# Altium schematic sheet UC-521.SchDoc
size A3
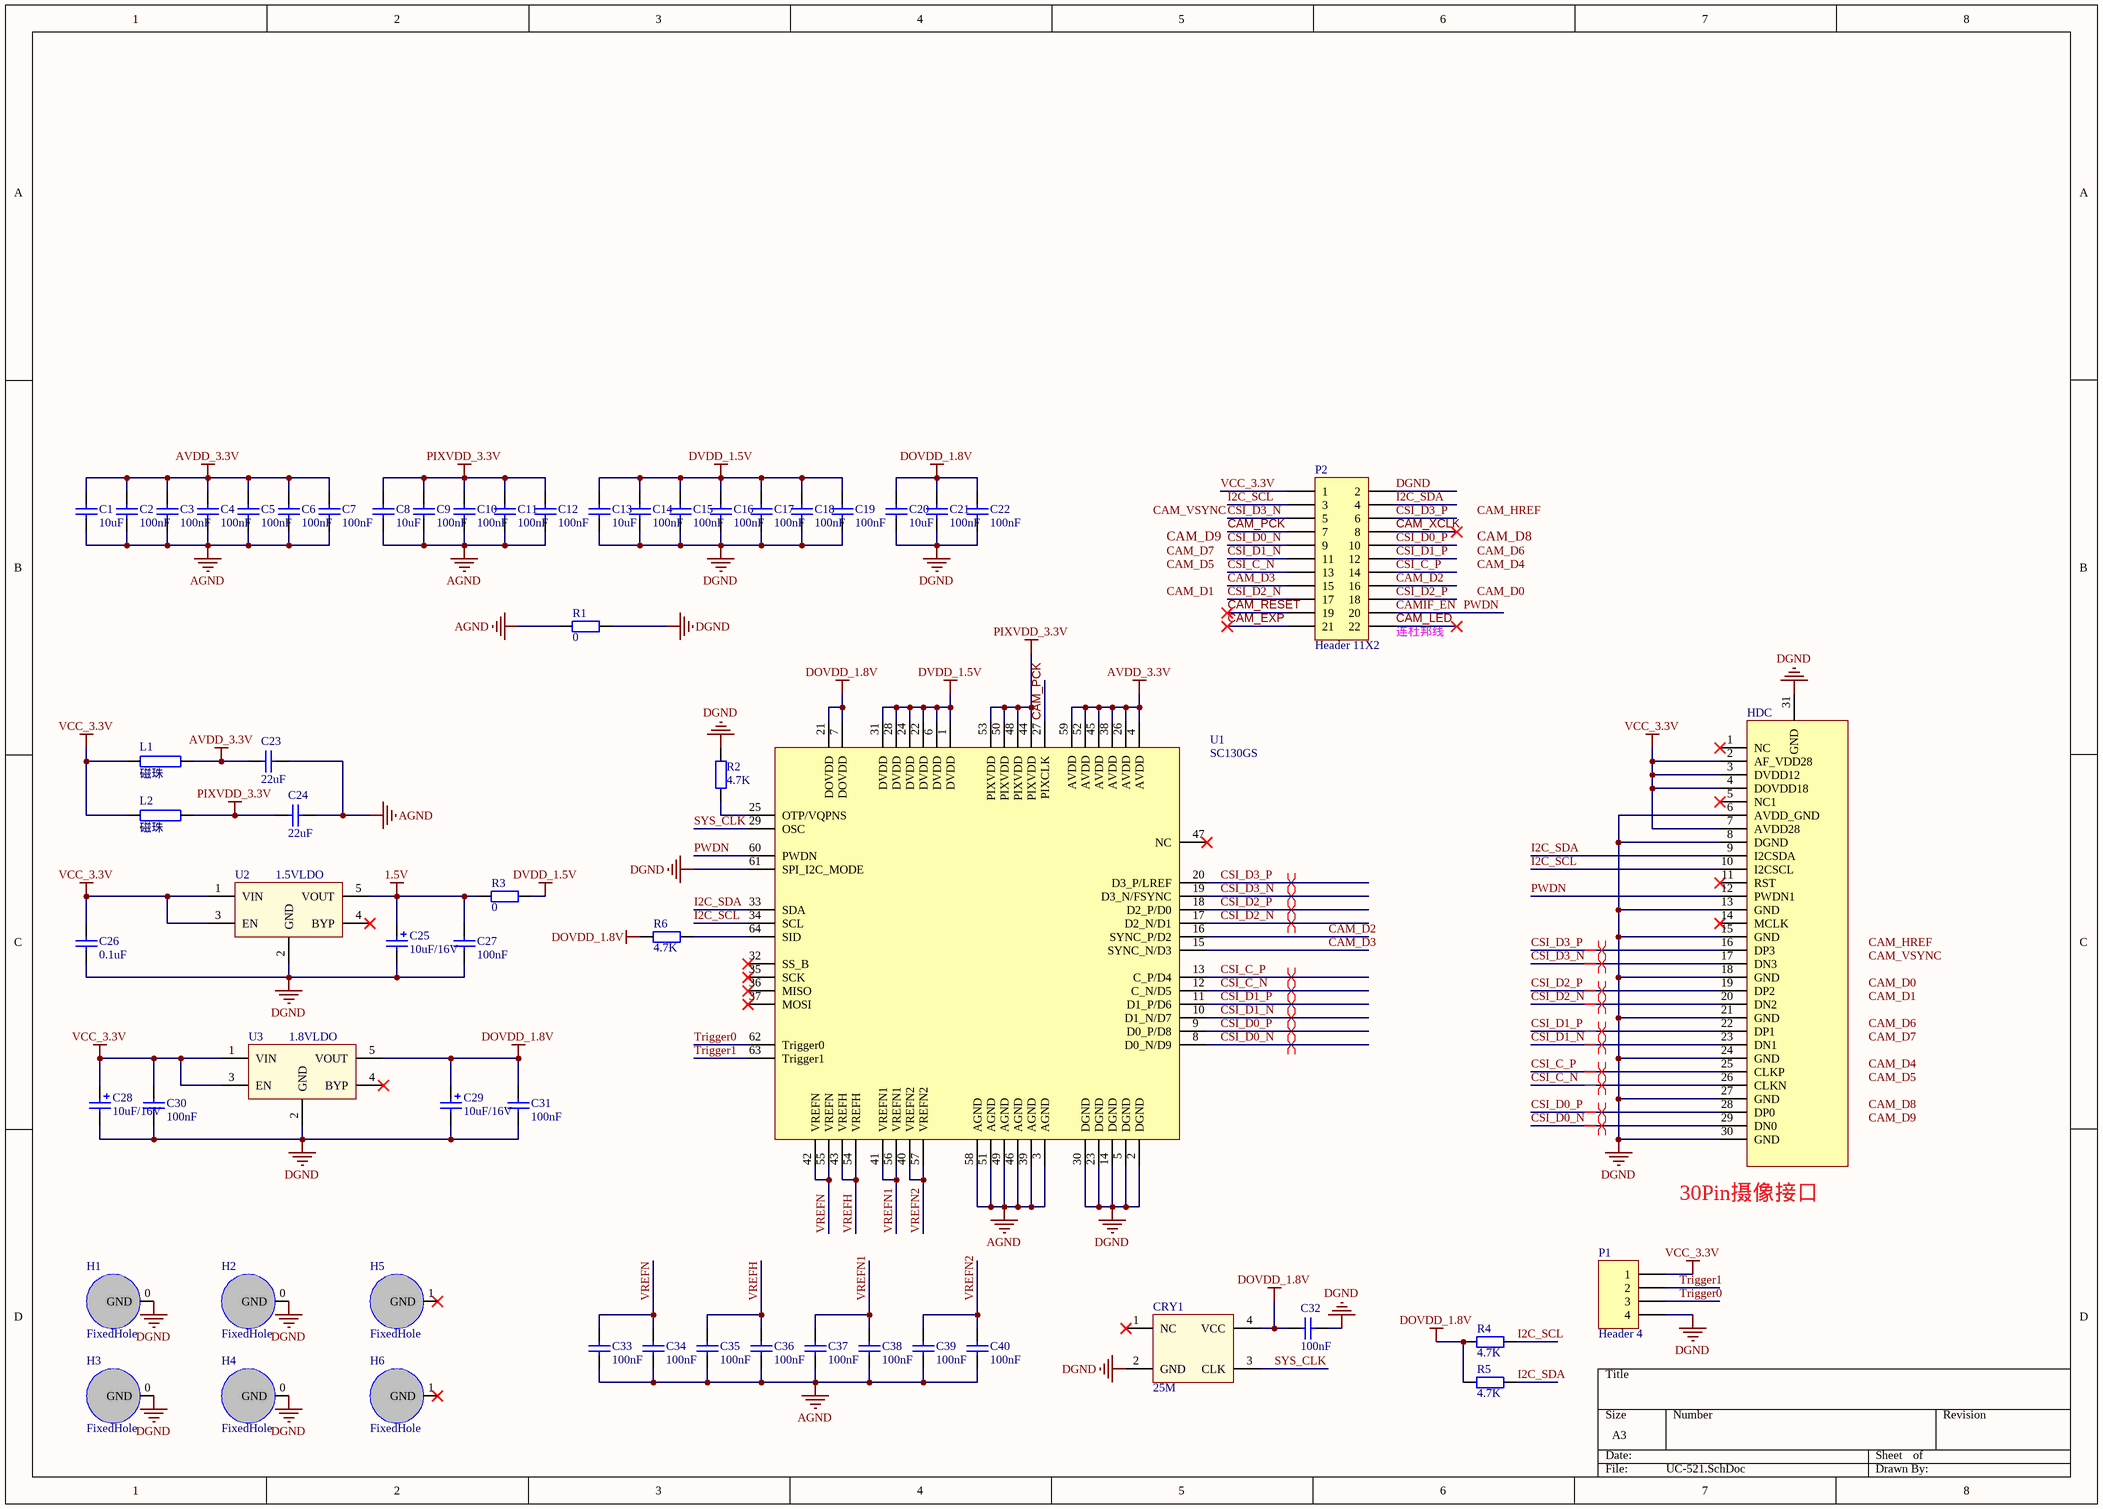
[diagram p0: UC-521.SchDoc]

## Parts
C1  10uF  [C0603]
C2  100nF  [C0603]
C3  100nF  [C0603]
C4  100nF  [C0603]
C5  100nF  [C0603]
C6  100nF  [C0603]
C7  100nF  [C0603]
C8  10uF  [C0603]
C9  100nF  [C0603]
C10  100nF  [C0603]
C11  100nF  [C0603]
C12  100nF  [C0603]
C13  10uF  [C0603]
C14  100nF  [C0603]
C15  100nF  [C0603]
C16  100nF  [C0603]
C17  100nF  [C0603]
C18  100nF  [C0603]
C19  100nF  [C0603]
C20  10uF  [C0603]
C21  100nF  [C0603]
C22  100nF  [C0603]
C23  22uF  [C0603]
C24  22uF  [C0603]
C25  10uF/16V  [钽电容（A型）]
C26  0.1uF  [C0603]
C27  100nF  [C0603]
C28  10uF/16V  [钽电容（A型）]
C29  10uF/16V  [钽电容（A型）]
C30  100nF  [C0603]
C31  100nF  [C0603]
C32  100nF  [C0603]
C33  100nF  [C0603]
C34  100nF  [C0603]
C35  100nF  [C0603]
C36  100nF  [C0603]
C37  100nF  [C0603]
C38  100nF  [C0603]
C39  100nF  [C0603]
C40  100nF  [C0603]
CRY1  25M  [爱普生晶振3.2×2.5MM]
H1  FixedHole  [HOLE_M2]
H2  FixedHole  [HOLE_M2]
H3  FixedHole  [HOLE_M2]
H4  FixedHole  [HOLE_M2]
H5  FixedHole  [HOLE_M2]
H6  FixedHole  [HOLE_M2]
HDC  Component_1  [FH12-30S-0.5SH]  (value not drawn)
L1  磁珠  [L0603]
L2  磁珠  [L0603]
P1  Header 4  [HDR1X4]
P2  Header 11X2  [HDR2X11]
R1  0  [R0603]
R2  4.7K  [R0603]
R3  0  [R0603]
R4  4.7K  [R0603]
R5  4.7K  [R0603]
R6  4.7K  [R0603]
U1  SC130GS  [LCC64-SC130GS]
U2  1.5VLDO  [SOT23-5]
U3  1.8VLDO  [SOT23-5]

## Nets
1.5V: C25.1 C27.1 R3.1 U2.5(VOUT)
AGND: C1.2 C2.2 C3.2 C4.2 C5.2 C6.2 C7.2 C8.2 C9.2 C10.2 C11.2 C12.2 C23.1 C24.1 C33.2 C34.2 C35.2 C36.2 C37.2 C38.2 C39.2 C40.2 R1.1 U1.3(AGND) U1.39(AGND) U1.46(AGND) U1.49(AGND) U1.51(AGND) U1.58(AGND)
AVDD_3.3V: C1.1 C2.1 C3.1 C4.1 C5.1 C6.1 C7.1 C23.2 L1.2 U1.4(AVDD) U1.26(AVDD) U1.38(AVDD) U1.45(AVDD) U1.52(AVDD) U1.59(AVDD)
DGND: C13.2 C14.2 C15.2 C16.2 C17.2 C18.2 C19.2 C20.2 C21.2 C22.2 C25.2 C26.2 C27.2 C28.2 C29.2 C30.2 C31.2 C32.2 CRY1.2(GND) H1.0(GND) H2.0(GND) H3.0(GND) H4.0(GND) HDC.6(AVDD_GND) HDC.8(DGND) HDC.13(GND) HDC.15(GND) HDC.18(GND) HDC.21(GND) HDC.24(GND) HDC.27(GND) HDC.30(GND) HDC.31(GND) P1.4 P2.2 R1.2 R2.1 U1.2(DGND) U1.5(DGND) U1.14(DGND) U1.23(DGND) U1.30(DGND) U1.61(SPI_I2C_MODE) U2.2(GND) U3.2(GND)
DOVDD_1.8V: C20.1 C21.1 C22.1 C29.1 C31.1 C32.1 CRY1.4(VCC) R4.1 R5.1 R6.1 U1.7(DOVDD) U1.21(DOVDD) U3.5(VOUT)
DVDD_1.5V: C13.1 C14.1 C15.1 C16.1 C17.1 C18.1 C19.1 R3.2 U1.1(DVDD) U1.6(DVDD) U1.22(DVDD) U1.24(DVDD) U1.28(DVDD) U1.31(DVDD)
PIXVDD_3.3V: C8.1 C9.1 C10.1 C11.1 C12.1 C24.2 L2.1 U1.44(PIXVDD) U1.48(PIXVDD) U1.50(PIXVDD) U1.53(PIXVDD)
VCC_3.3V: C26.1 C28.1 C30.1 HDC.2(AF_VDD28) HDC.3(DVDD12) HDC.4(DOVDD18) HDC.7(AVDD28) L1.1 L2.2 P1.1 P2.1 U2.1(VIN) U2.3(EN) U3.1(VIN) U3.3(EN)
CAM_D2: P2.16 U1.16(SYNC_P/D2)
CAM_D3: P2.15 U1.15(SYNC_N/D3)
CAM_EXP: P2.21
CAM_LED: P2.22
CAM_PCK: P2.7 U1.27(PIXCLK)
CAM_RESET: P2.19
CAM_XCLK: P2.8
CAMIF_EN: HDC.12(PWDN1) P2.20 U1.60(PWDN)  [also labelled PWDN]
CSI_C_N: HDC.26(CLKN) P2.13 U1.12(C_N/D5)
CSI_C_P: HDC.25(CLKP) P2.14 U1.13(C_P/D4)
CSI_D0_N: HDC.29(DN0) P2.9 U1.8(D0_N/D9)
CSI_D0_P: HDC.28(DP0) P2.10 U1.9(D0_P/D8)
CSI_D1_N: HDC.23(DN1) P2.11 U1.10(D1_N/D7)
CSI_D1_P: HDC.22(DP1) P2.12 U1.11(D1_P/D6)
CSI_D2_N: HDC.20(DN2) P2.17 U1.17(D2_N/D1)
CSI_D2_P: HDC.19(DP2) P2.18 U1.18(D2_P/D0)
CSI_D3_N: HDC.17(DN3) P2.5 U1.19(D3_N/FSYNC)
CSI_D3_P: HDC.16(DP3) P2.6 U1.20(D3_P/LREF)
I2C_SCL: HDC.10(I2CSCL) P2.3 R4.2 U1.34(SCL)
I2C_SDA: HDC.9(I2CSDA) P2.4 R5.2 U1.33(SDA)
SYS_CLK: CRY1.3(CLK) U1.29(OSC)
Trigger0: P1.3 U1.62(Trigger0)
Trigger1: P1.2 U1.63(Trigger1)
VREFH: C35.1 C36.1 U1.43(VREFH) U1.54(VREFH)
VREFN: C33.1 C34.1 U1.42(VREFN) U1.55(VREFN)
VREFN1: C37.1 C38.1 U1.41(VREFN1) U1.56(VREFN1)
VREFN2: C39.1 C40.1 U1.40(VREFN2) U1.57(VREFN2)
NetR2_2: R2.2 U1.25(OTP/VQPNS)
NetR6_2: R6.2 U1.64(SID)

Not connected (* = marked no-connect by the designer): CRY1 1(NC)*; H5 1(GND)*; H6 1(GND)*; HDC 1(NC)* 5(NC1)* 11(RST)* 14(MCLK)*; U1 32(SS_B)* 35(SCK)* 36(MISO)* 37(MOSI)* 47(NC)*; U2 4(BYP)*; U3 4(BYP)*

## Layout directives
differential pair: CSI_C_N, CSI_C_P, CSI_D0_N, CSI_D0_P, CSI_D1_N, CSI_D1_P, CSI_D2_N, CSI_D2_P, CSI_D3_N, CSI_D3_P

## Notes on the sheet
- (near P2) 连杜邦线
- (near HDC) 30Pin摄像接口
- Labels drawn without touching a wire or pin: CAM_D0, CAM_D1, CAM_D4, CAM_D5, CAM_D6, CAM_D7, CAM_D8, CAM_D9, CAM_HREF, CAM_VSYNC

## Library data of the parts
C1-C22 C32-C40 = Cap: 50V/8.2u/0805; Value: 100n; Published: 8-Jun-2000; LatestRevisionDate: 17-Jul-2002; LatestRevisionNote: Re-released for DXP Platform.; PackageReference: RAD-0.3; Publisher: Altium Limited
C23 C24 C26 C27 C30 C31 = Cap: Capacitor; Value: 100pF; Published: 8-Jun-2000; LatestRevisionDate: 17-Jul-2002; LatestRevisionNote: Re-released for DXP Platform.; PackageReference: RAD-0.3; Publisher: Altium Limited
C25 C28 C29 = Cap Pol2: Polarized Capacitor (Axial); Value: 0.1uF; Published: 8-Jun-2000; LatestRevisionDate: 17-Jul-2002; LatestRevisionNote: Re-released for DXP Platform.; PackageReference: POLAR0.8; Publisher: Altium Limited
CRY1 = 24M
H1-H6 = 固定孔
L1 L2 = RES
P1 = Header 4: Header, 4-Pin; LatestRevisionDate: 17-Jul-2002; LatestRevisionNote: Re-released for DXP Platform.; Publisher: Altium Limited
P2 = Header 11X2: Header, 11-Pin, Dual row; LatestRevisionDate: 17-Jul-2002; LatestRevisionNote: Re-released for DXP Platform.; Publisher: Altium Limited
R1-R6 = Res2: Resistor; Value: 49.9; Published: 8-Jun-2000; LatestRevisionDate: 17-Jul-2002; LatestRevisionNote: Re-released for DXP Platform.; PackageReference: AXIAL-0.4; Publisher: Altium Limited
U2 U3 = 2.8VLDO